# Altium schematic sheet BaseCircuit.SchDoc
size A4; SheetNumber: 1
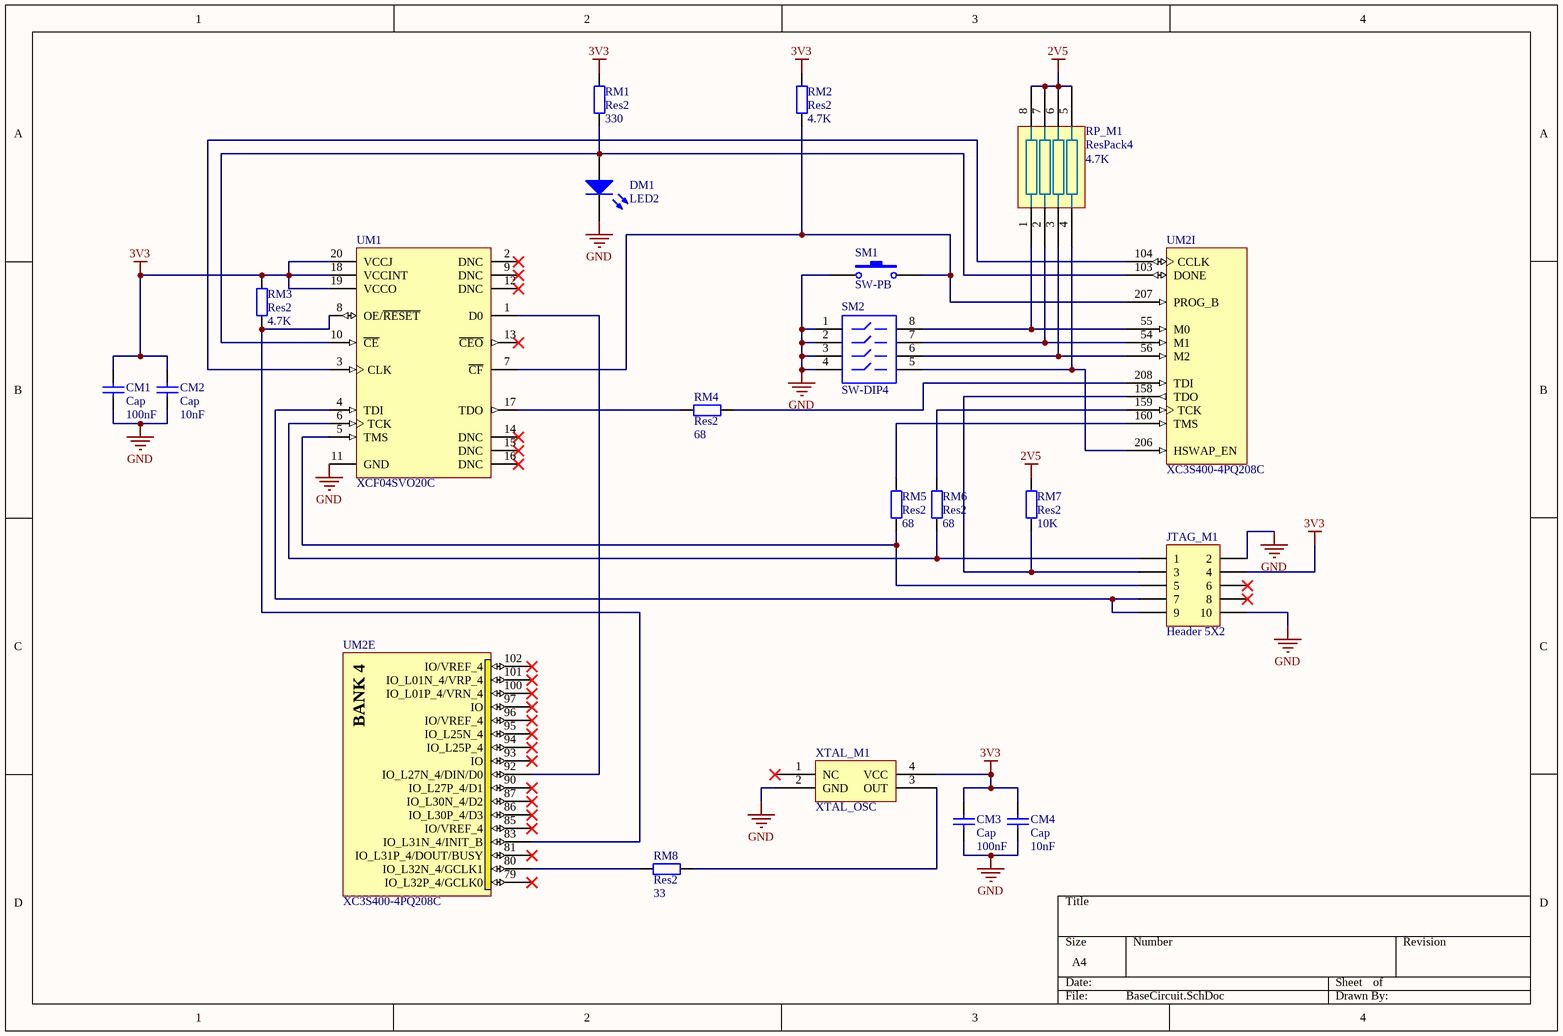
[diagram p0: BaseCircuit.SchDoc]

## Parts
CM1  Cap  value 100nF  [C0805]
CM2  Cap  value 10nF  [C0805]
CM3  Cap  value 100nF  [C0805]
CM4  Cap  value 10nF  [C0805]
DM1  LED2  [3.2X1.6X1.1]
JTAG_M1  Header 5X2  [HDR2X5]
RM1  Res2  value 330  [6-0805_N]
RM2  Res2  value 4.7K  [6-0805_N]
RM3  Res2  value 4.7K  [6-0805_N]
RM4  Res2  value 68  [6-0805_N]
RM5  Res2  value 68  [6-0805_N]
RM6  Res2  value 68  [6-0805_N]
RM7  Res2  value 10K  [6-0805_N]
RM8  Res2  value 33  [6-0805_N]
RP_M1  ResPack4  value 4.7K  [SSOP8]
SM1  SW-PB  [SPST-2]
SM2  SW-DIP4  [DIP-8]
UM1  XCF04SVO20C  [VO20_N]
UM2  XC3S400-4PQ208C  [PQ208_N]  (parts E,I of 11)
XTAL_M1  XTAL_OSC  [XTAL_HALF]

## Nets
2V5: RM7.2 RP_M1.5 RP_M1.6 RP_M1.7 RP_M1.8
3V3: CM1.2 CM2.2 CM3.2 CM4.2 JTAG_M1.4 RM1.2 RM2.2 RM3.2 UM1.18(VCCINT) UM1.19(VCCO) UM1.20(VCCJ) XTAL_M1.4(VCC)
GND: CM1.1 CM2.1 CM3.1 CM4.1 DM1.2(K) JTAG_M1.2 JTAG_M1.10 SM1.1 SM2.1 SM2.2 SM2.3 SM2.4 UM1.11(GND) XTAL_M1.2(GND)
NetDM1_1: DM1.1(A) RM1.1 UM1.10(~{CE}) UM2.103(DONE)
NetJTAG_M1_1: JTAG_M1.1 RM6.1 UM1.6(TCK)
NetJTAG_M1_3: JTAG_M1.3 RM7.1 UM2.158(TDO)
NetJTAG_M1_5: JTAG_M1.5 RM5.1 UM1.5(TMS)
NetJTAG_M1_7: JTAG_M1.7 JTAG_M1.9 UM1.4(TDI)
NetRM2_1: RM2.1 SM1.2 UM1.7(~{CF}) UM2.207(PROG_B)
NetRM3_1: RM3.1 UM1.8(OE/~{RESET}) UM2.83(IO_L31N_4/INIT_B)
NetRM4_1: RM4.1 UM2.208(TDI)
NetRM4_2: RM4.2 UM1.17(TDO)
NetRM5_2: RM5.2 UM2.160(TMS)
NetRM6_2: RM6.2 UM2.159(TCK)
NetRM8_1: RM8.1 XTAL_M1.3(OUT)
NetRM8_2: RM8.2 UM2.80(IO_L32N_4/GCLK1)
NetRP_M1_1: RP_M1.1 SM2.8 UM2.55(M0)
NetRP_M1_2: RP_M1.2 SM2.7 UM2.54(M1)
NetRP_M1_3: RP_M1.3 SM2.6 UM2.56(M2)
NetRP_M1_4: RP_M1.4 SM2.5 UM2.206(HSWAP_EN)
NetUM1_1: UM1.1(D0) UM2.92(IO_L27N_4/DIN/D0)
NetUM1_3: UM1.3(CLK) UM2.104(CCLK)

Not connected (* = marked no-connect by the designer): JTAG_M1 6* 8*; UM1 2(DNC)* 9(DNC)* 12(DNC)* 13(~{CEO})* 14(DNC)* 15(DNC)* 16(DNC)*; UM2 79(IO_L32P_4/GCLK0)* 81(IO_L31P_4/DOUT/BUSY)* 85(IO/VREF_4)* 86(IO_L30P_4/D3)* 87(IO_L30N_4/D2)* 90(IO_L27P_4/D1)* 93(IO)* 94(IO_L25P_4)* 95(IO_L25N_4)* 96(IO/VREF_4)* 97(IO)* 100(IO_L01P_4/VRN_4)* 101(IO_L01N_4/VRP_4)* 102(IO/VREF_4)*; XTAL_M1 1(NC)*

## Notes on the sheet
- (in symbol XC3S400-4PQ208C, part E) BANK 4

## Library data of the parts
CM1-CM4 = Cap: Capacitor; Published: 8-Jun-2000; LatestRevisionDate: 17-Jul-2002; LatestRevisionNote: Re-released for DXP Platform.; PackageReference: RAD-0.3; Publisher: Altium Limited; PackageDescription: Radial Cap, Thru-Hole; 2 Leads; 0.3 in Pin Spacing
DM1 = LED2: Typical RED, GREEN, YELLOW, AMBER GaAs LED; Published: 8-Jun-2000; LatestRevisionDate: 17-Jul-2002; LatestRevisionNote: Re-released for DXP Platform.; PackageVersion: Feb-2002; PackageReference: 3.2X1.6X1.1; Publisher: Altium Limited; PackageDescription: SM LED; 2 Flat Leads
JTAG_M1 = Header 5X2: Header, 5-Pin, Dual row; LatestRevisionDate: 17-Jul-2002; LatestRevisionNote: Re-released for DXP Platform.; Publisher: Altium Limited
RM1-RM8 = Res2: Resistor; Published: 8-Jun-2000; LatestRevisionDate: 17-Jul-2002; LatestRevisionNote: Re-released for DXP Platform.; PackageReference: AXIAL-0.4; Publisher: Altium Limited; PackageDescription: Axial Device, Thru-Hole; 2 Leads; 0.4 in Pin Spacing
SM1 = SW-PB: Switch; Published: 24-Mar-1999; LatestRevisionDate: 17-Jul-2002; LatestRevisionNote: Re-released for DXP Platform.; PackageReference: SPST-2; Publisher: Altium Limited; PackageDescription: Switch; 2 Leads
SM2 = SW-DIP4: DIP Switch; Published: 24-Mar-1999; LatestRevisionDate: 17-Jul-2002; LatestRevisionNote: Re-released for DXP Platform.; PackageReference: DIP-8; Publisher: Altium Limited
UM1 = XCF04SVO20C: XCF00S Series, Platform Flash In-System Programmable Configuration 3.3V PROM, 20-Pin TSOP, 4-Megabit, Commercial Grade; Published: 17-Sep-2003; LatestRevisionDate: 16-Nov-2009; LatestRevisionNote: Updated to datasheet version 2.17, Oct-2009.; DatasheetVersion: ver2.17, Oct-2009; PackageVersion: ver1.3, Dec-2008; PackageReference: VO20; Publisher: Altium Limited; PackageDescription: 20-Pin Thin Shrink Small Outline Package (VO20); Supplier 1: Digi-Key; Supplier Part Number 1: XCF04SVO20C-ND; Code_JEDEC: MO-153-AC; ComponentLink1Description: Platform Flash Datasheet; ComponentLink1URL: http://www.xilinx.com/support/documentation/data_sheets/ds123.pdf; ComponentLink2Description: VO20 Package Drawing; ComponentLink2URL: http://www.xilinx.com/support/documentation/package_specs/vo20.pdf; ComponentLink3Description: Configuration PROM Documents; ComponentLink3URL: http://www.xilinx.com/support/documentation/configuration_proms.htm; ComponentLink4Description: Xilinx.com Home; ComponentLink4URL: http://www.xilinx.com
UM2 = XC3S400-4PQ208C: Spartan-3 1.2V FPGA, 141 User I/Os, 208-Pin PQFP, Standard Performance, Commercial Grade; OrderingInformation: Additional code may have to be appended for different mask revision devices.; Published: 17-Sep-2003; LatestRevisionDate: 01-Mar-2010; LatestRevisionNote: Updated to datasheet version 2.5 Dec-2009.; DatasheetVersion: ver2.5, Dec-2009; PackageVersion: ver1.2, Jun-2004; PackageReference: PQ208; Publisher: Altium Limited; PackageDescription: 208-Pin Plastic Quad Flat Pack (PQ208); Supplier 1: Digi-Key; Supplier Part Number 1: XC3S400-4PQ208C-ND; Code_JEDEC: MS-029-FA-1; ComponentLink1Description: Spartan-3 Datasheet; ComponentLink1URL: http://www.xilinx.com/support/documentation/data_sheets/ds099.pdf; ComponentLink2Description: PQ208 Package Drawing; ComponentLink2URL: http://www.xilinx.com/support/documentation/package_specs/pq208.pdf; ComponentLink3Description: Spartan-3 Documents; ComponentLink3URL: http://www.xilinx.com/support/documentation/spartan-3.htm; ComponentLink4Description: Xilinx.com Home; ComponentLink4URL: http://www.xilinx.com